# Altium schematic sheet Voltage_Regulator.SchDoc
size A4; SheetNumber: 14; SheetTotal: 14
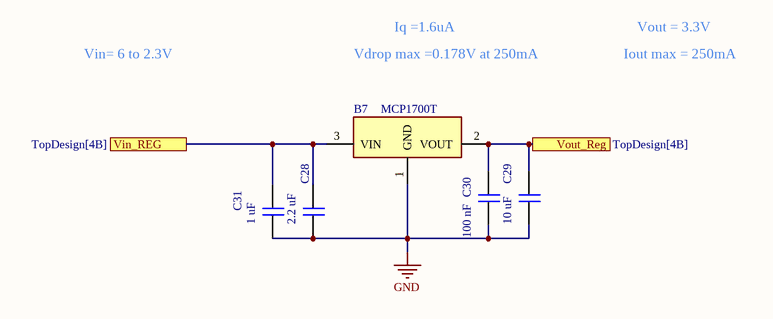
[diagram p0: Voltage_Regulator.SchDoc]

## Parts
B7  MCP1700T  [MCP1700T-SOT23]
C28  2.2 uF  [CAP_0603]
C29  10 uF  [CAP_0603]
C30  100 nF  [CAP_0603]
C31  1 uF  [CAP_0603]

## Ports
Vin_REG (see TopDesign[4B]), Vout_Reg (see TopDesign[4B])

## Nets
GND: B7.1(GND) C28.1 C29.1 C30.1 C31.1
Vin_REG: B7.3(VIN) C28.2 C31.2 ; port Vin_REG
Vout_Reg: B7.2(VOUT) C29.2 C30.2 ; port Vout_Reg

## Notes on the sheet
- Vin= 6 to 2.3V
- Vdrop max =0.178V at 250mA
- Iq =1.6uA
- Iout max = 250mA
- Vout = 3.3V

## Library data of the parts
B7 = MCP1700T-SOT23: LDO voltage regulator 250mA Isupply 1.6uA; MPN: Microchip; MFPN: MCP1700T-3302E/TT; Geometry.Height: 1.12mm; Datasheet Link: https://datasheet.datasheetarchive.com/originals/distributors/SFDatasheet-4/sf-00090030.pdf; LCSC: C39051; Iq: 1.6 uA
C28-C31 = Cap SMD: Cap SMD.